# EAGLE design CDMU (EAGLE 6.4)

## Sheet 1 of 3
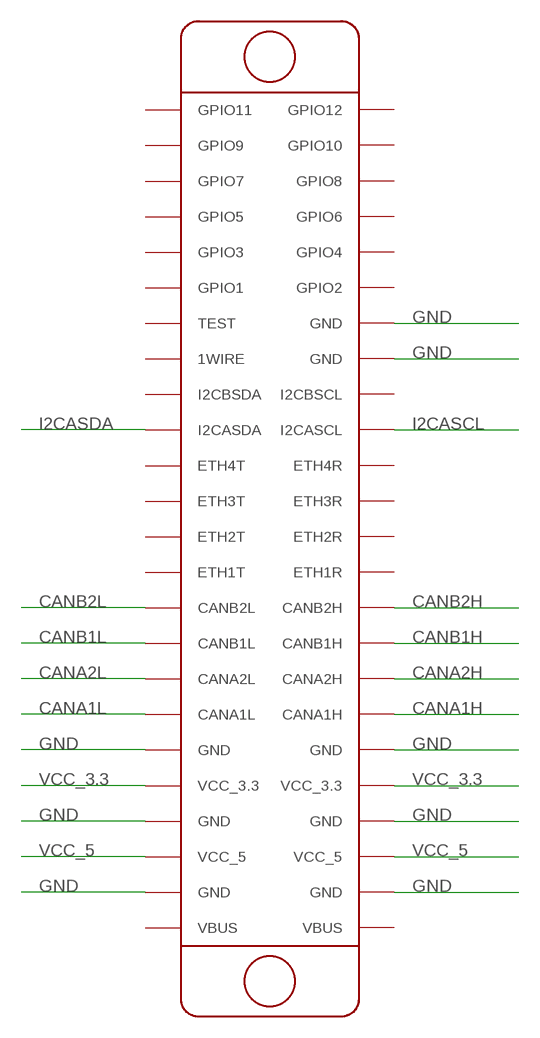
[diagram p0: schematic, sheet 1]

### Parts
U$1  CUBESAT_PCB  [CUBESAT_PCB]

### Nets
CANA1H: U$1.CANA1H ; also sheet 3
CANA1L: U$1.CANA1L ; also sheet 3
CANA2H: U$1.CANA2H ; also sheet 3
CANA2L: U$1.CANA2L ; also sheet 3
CANB1H: U$1.CANB1H ; also sheet 3
CANB1L: U$1.CANB1L ; also sheet 3
CANB2H: U$1.CANB2H ; also sheet 3
CANB2L: U$1.CANB2L ; also sheet 3
GND: U$1.GND@5(GND) U$1.GND@6(GND) U$1.GND@7(GND) U$1.GND@8(GND) U$1.GND@9(GND) U$1.GND@10(GND) U$1.GND@11(GND) U$1.GND@12(GND) ; also sheet 2,3
I2CASCL: U$1.I2CASCL ; also sheet 2
I2CASDA: U$1.I2CASDA ; also sheet 2
VCC_3.3: U$1.VCC_3.3@1(VCC_3.3) U$1.VCC_3.3@2(VCC_3.3) ; also sheet 2,3
VCC_5: U$1.VCC_5@1(VCC_5) U$1.VCC_5@2(VCC_5) ; also sheet 2
Unconnected: U$1.1WIRE U$1.ETH1R U$1.ETH1T U$1.ETH2R U$1.ETH2T U$1.ETH3R U$1.ETH3T U$1.ETH4R U$1.ETH4T U$1.GPIO1 U$1.GPIO2 U$1.GPIO3 U$1.GPIO4 U$1.GPIO5 U$1.GPIO6 U$1.GPIO7 U$1.GPIO8 U$1.GPIO9 U$1.GPIO10 U$1.GPIO11 U$1.GPIO12 U$1.I2CBSCL U$1.I2CBSDA U$1.TEST U$1.VBUS@1(VBUS) U$1.VBUS@2(VBUS)

## Sheet 2 of 3
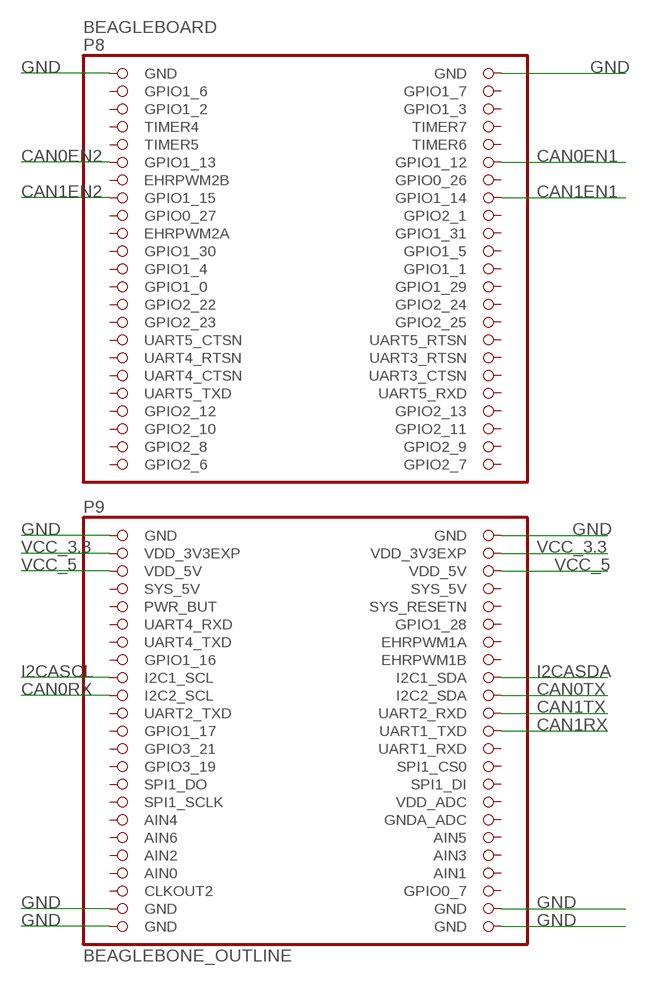
[diagram p1: schematic, sheet 2]

### Parts
BEAGLEBOARD  BEAGLEBONE_OUTLINE  [BEAGLEBONE_SHIELD]

### Nets
CAN0EN1: BEAGLEBOARD.12(GPIO1_12) ; also sheet 3
CAN0EN2: BEAGLEBOARD.11(GPIO1_13) ; also sheet 3
CAN0RX: BEAGLEBOARD.65(I2C2_SCL) ; also sheet 3
CAN0TX: BEAGLEBOARD.66(I2C2_SDA) ; also sheet 3
CAN1EN1: BEAGLEBOARD.16(GPIO1_14) ; also sheet 3
CAN1EN2: BEAGLEBOARD.15(GPIO1_15) ; also sheet 3
CAN1RX: BEAGLEBOARD.70(UART1_TXD) ; also sheet 3
CAN1TX: BEAGLEBOARD.68(UART2_RXD) ; also sheet 3
GND: BEAGLEBOARD.1(GND) BEAGLEBOARD.2(GND) BEAGLEBOARD.47(GND) BEAGLEBOARD.48(GND) BEAGLEBOARD.89(GND) BEAGLEBOARD.90(GND) BEAGLEBOARD.91(GND) BEAGLEBOARD.92(GND) ; also sheet 1,3
I2CASCL: BEAGLEBOARD.63(I2C1_SCL) ; also sheet 1
I2CASDA: BEAGLEBOARD.64(I2C1_SDA) ; also sheet 1
VCC_3.3: BEAGLEBOARD.49(VDD_3V3EXP) BEAGLEBOARD.50(VDD_3V3EXP) ; also sheet 1,3
VCC_5: BEAGLEBOARD.51(VDD_5V) BEAGLEBOARD.52(VDD_5V) ; also sheet 1
Unconnected: BEAGLEBOARD.3(GPIO1_6) BEAGLEBOARD.4(GPIO1_7) BEAGLEBOARD.5(GPIO1_2) BEAGLEBOARD.6(GPIO1_3) BEAGLEBOARD.7(TIMER4) BEAGLEBOARD.8(TIMER7) BEAGLEBOARD.9(TIMER5) BEAGLEBOARD.10(TIMER6) BEAGLEBOARD.13(EHRPWM2B) BEAGLEBOARD.14(GPIO0_26) BEAGLEBOARD.17(GPIO0_27) BEAGLEBOARD.18(GPIO2_1) BEAGLEBOARD.19(EHRPWM2A) BEAGLEBOARD.20(GPIO1_31) BEAGLEBOARD.21(GPIO1_30) BEAGLEBOARD.22(GPIO1_5) BEAGLEBOARD.23(GPIO1_4) BEAGLEBOARD.24(GPIO1_1) BEAGLEBOARD.25(GPIO1_0) BEAGLEBOARD.26(GPIO1_29) BEAGLEBOARD.27(GPIO2_22) BEAGLEBOARD.28(GPIO2_24) BEAGLEBOARD.29(GPIO2_23) BEAGLEBOARD.30(GPIO2_25) BEAGLEBOARD.31(UART5_CTSN) BEAGLEBOARD.32(UART5_RTSN) BEAGLEBOARD.33(UART4_RTSN) BEAGLEBOARD.34(UART3_RTSN) BEAGLEBOARD.35(UART4_CTSN) BEAGLEBOARD.36(UART3_CTSN) BEAGLEBOARD.37(UART5_TXD) BEAGLEBOARD.38(UART5_RXD) BEAGLEBOARD.39(GPIO2_12) BEAGLEBOARD.40(GPIO2_13) BEAGLEBOARD.41(GPIO2_10) BEAGLEBOARD.42(GPIO2_11) BEAGLEBOARD.43(GPIO2_8) BEAGLEBOARD.44(GPIO2_9) BEAGLEBOARD.45(GPIO2_6) BEAGLEBOARD.46(GPIO2_7) BEAGLEBOARD.54(SYS_5V) BEAGLEBOARD.55(PWR_BUT) BEAGLEBOARD.56(SYS_RESETN) BEAGLEBOARD.57(UART4_RXD) BEAGLEBOARD.58(GPIO1_28) BEAGLEBOARD.59(UART4_TXD) BEAGLEBOARD.60(EHRPWM1A) BEAGLEBOARD.61(GPIO1_16) BEAGLEBOARD.62(EHRPWM1B) BEAGLEBOARD.67(UART2_TXD) BEAGLEBOARD.69(GPIO1_17) BEAGLEBOARD.71(GPIO3_21) BEAGLEBOARD.72(UART1_RXD) BEAGLEBOARD.73(GPIO3_19) BEAGLEBOARD.74(SPI1_CS0) BEAGLEBOARD.75(SPI1_DO) BEAGLEBOARD.76(SPI1_DI) BEAGLEBOARD.77(SPI1_SCLK) BEAGLEBOARD.78(VDD_ADC) BEAGLEBOARD.79(AIN4) BEAGLEBOARD.80(GNDA_ADC) BEAGLEBOARD.81(AIN6) BEAGLEBOARD.82(AIN5) BEAGLEBOARD.83(AIN2) BEAGLEBOARD.84(AIN3) BEAGLEBOARD.86(AIN1) BEAGLEBOARD.87(CLKOUT2) BEAGLEBOARD.88(GPIO0_7)

## Sheet 3 of 3
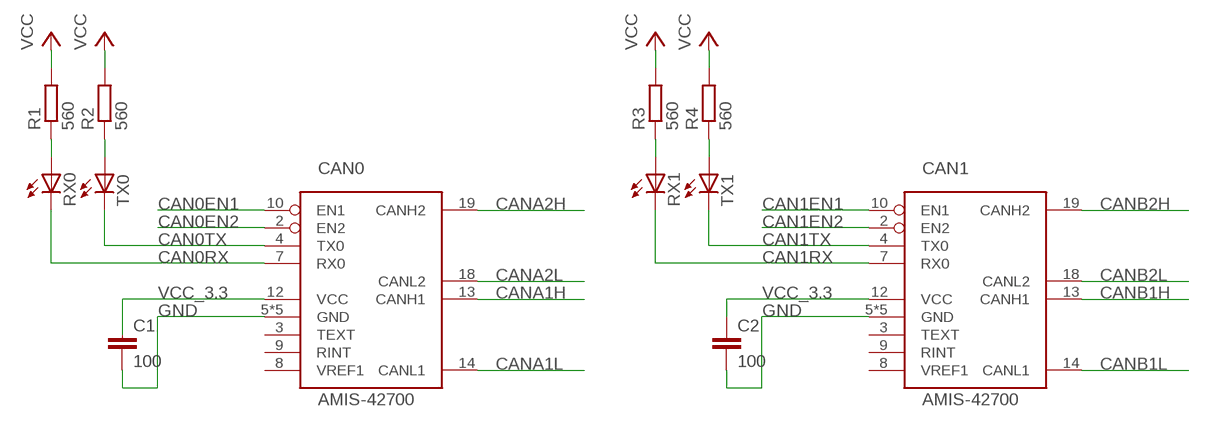
[diagram p2: schematic, sheet 3]

### Parts
C1  100  C-EUC0805  [C0805]
C2  100  C-EUC0805  [C0805]
CAN0  AMIS-42700  [SOIC20]
CAN1  AMIS-42700  [SOIC20]
R1  560  R-EU_R0805  [R0805]
R2  560  R-EU_R0805  [R0805]
R3  560  R-EU_R0805  [R0805]
R4  560  R-EU_R0805  [R0805]
RX0  LED3MM  [LED3MM]
RX1  LED3MM  [LED3MM]
TX0  LED3MM  [LED3MM]
TX1  LED3MM  [LED3MM]

### Nets
CAN0EN1: CAN0.10(EN1) ; also sheet 2
CAN0EN2: CAN0.2(EN2) ; also sheet 2
CAN0RX: CAN0.7(RX0) RX0.K(C) ; also sheet 2
CAN0TX: CAN0.4(TX0) TX0.K(C) ; also sheet 2
CAN1EN1: CAN1.10(EN1) ; also sheet 2
CAN1EN2: CAN1.2(EN2) ; also sheet 2
CAN1RX: CAN1.7(RX0) RX1.K(C) ; also sheet 2
CAN1TX: CAN1.4(TX0) TX1.K(C) ; also sheet 2
CANA1H: CAN0.13(CANH1) ; also sheet 1
CANA1L: CAN0.14(CANL1) ; also sheet 1
CANA2H: CAN0.19(CANH2) ; also sheet 1
CANA2L: CAN0.18(CANL2) ; also sheet 1
CANB1H: CAN1.13(CANH1) ; also sheet 1
CANB1L: CAN1.14(CANL1) ; also sheet 1
CANB2H: CAN1.19(CANH2) ; also sheet 1
CANB2L: CAN1.18(CANL2) ; also sheet 1
GND: C1.2 C2.2 CAN0.5(GND) CAN0.6(GND) CAN0.15(GND) CAN0.16(GND) CAN0.17(GND) CAN1.5(GND) CAN1.6(GND) CAN1.15(GND) CAN1.16(GND) CAN1.17(GND) ; also sheet 1,2
N$1: R1.1 RX0.A
N$2: R2.1 TX0.A
N$3: R3.1 RX1.A
N$4: R4.1 TX1.A
VCC_3.3: C1.1 C2.1 CAN0.12(VCC) CAN1.12(VCC) R1.2 R2.2 R3.2 R4.2 ; supply symbol labelled VCC ; also sheet 1,2
Unconnected: CAN0.3(TEXT) CAN0.8(VREF1) CAN0.9(RINT) CAN1.3(TEXT) CAN1.8(VREF1) CAN1.9(RINT)

## Power pins joined to a net without a drawn wire
AIN0: BEAGLEBOARD.85(AIN0)
SYS_5V: BEAGLEBOARD.53(SYS_5V)

## Library data of the parts
BEAGLEBOARD = beaglebone:BEAGLEBONE_OUTLINE: Should match A3 pinout - but not completely tested
C1 C2 = rcl:C-EU: CAPACITOR, European symbol
CAN0 CAN1 = amis(1):AMIS-42700
R1-R4 = rcl:R-EU_: RESISTOR, European symbol
RX0 RX1 TX0 TX1 = adafruit:LED: LED OSRAM: - CHIPLED LG R971, LG N971, LY N971, LG Q971, LY Q971, LO R971, LY R971 LH N974, LH R974 LS Q976, LO Q976, LY Q976 LO Q996 - Hyper CHIPLED LW Q18S LB Q993, LB Q99A, LB R99A - SideLED LS A670, LO A670, LY A670, LG A670, LP A670 LB A673, LV A673, LT A673, LW A673 LH A674 LY A675 LS A676, LA A676, LO A676, LY A676, LW A676 LS A679, LY A679, LG A679 - Hyper Micro SIDELED® LS Y876, LA Y876, LO Y876, LY Y876 LT Y87S - SmartLED LW L88C, LW L88S LB L89C, LB L89S, LG L890 LS L89K, LO L89K, LY L89K LS L896, LA L896, LO L896, LY L896 - TOPLED LS T670, LO T670, LY T670, LG T670, LP T670 LSG T670, LSP T670, LSY T670, LOP T670, LYG T670 LG T671, LOG T671, LSG T671 LB T673, LV T673, LT T673, LW T673 LH T674 LS T676, LA T676, LO T676, LY T676, LB T676, LH T676, LSB T676, LW T676 LB T67C, LV T67C, LT T67C, LS T67K, LO T67K, LY T67K, LW E67C LS E67B, LA E67B, LO E67B, LY E67B, LB E67C, LV E67C, LT E67C LW T67C LS T679, LY T679, LG T679 LS T770, LO T770, LY T770, LG T770, LP T770 LB T773, LV T773, LT T773, LW T773 LH T774 LS E675, LA E675, LY E675, LS T675 LS T776, LA T776, LO T776, LY T776, LB T776 LHGB T686 LT T68C, LB T68C - Hyper Mini TOPLED® LB M676 - Mini TOPLED Santana® LG M470 LS M47K, LO M47K, LY M47K Source: http://www.osram.convergy.de/
U$1 = CubeSat_PCB_bis:CUBESAT_PCB: OpenCube PCB

## Board
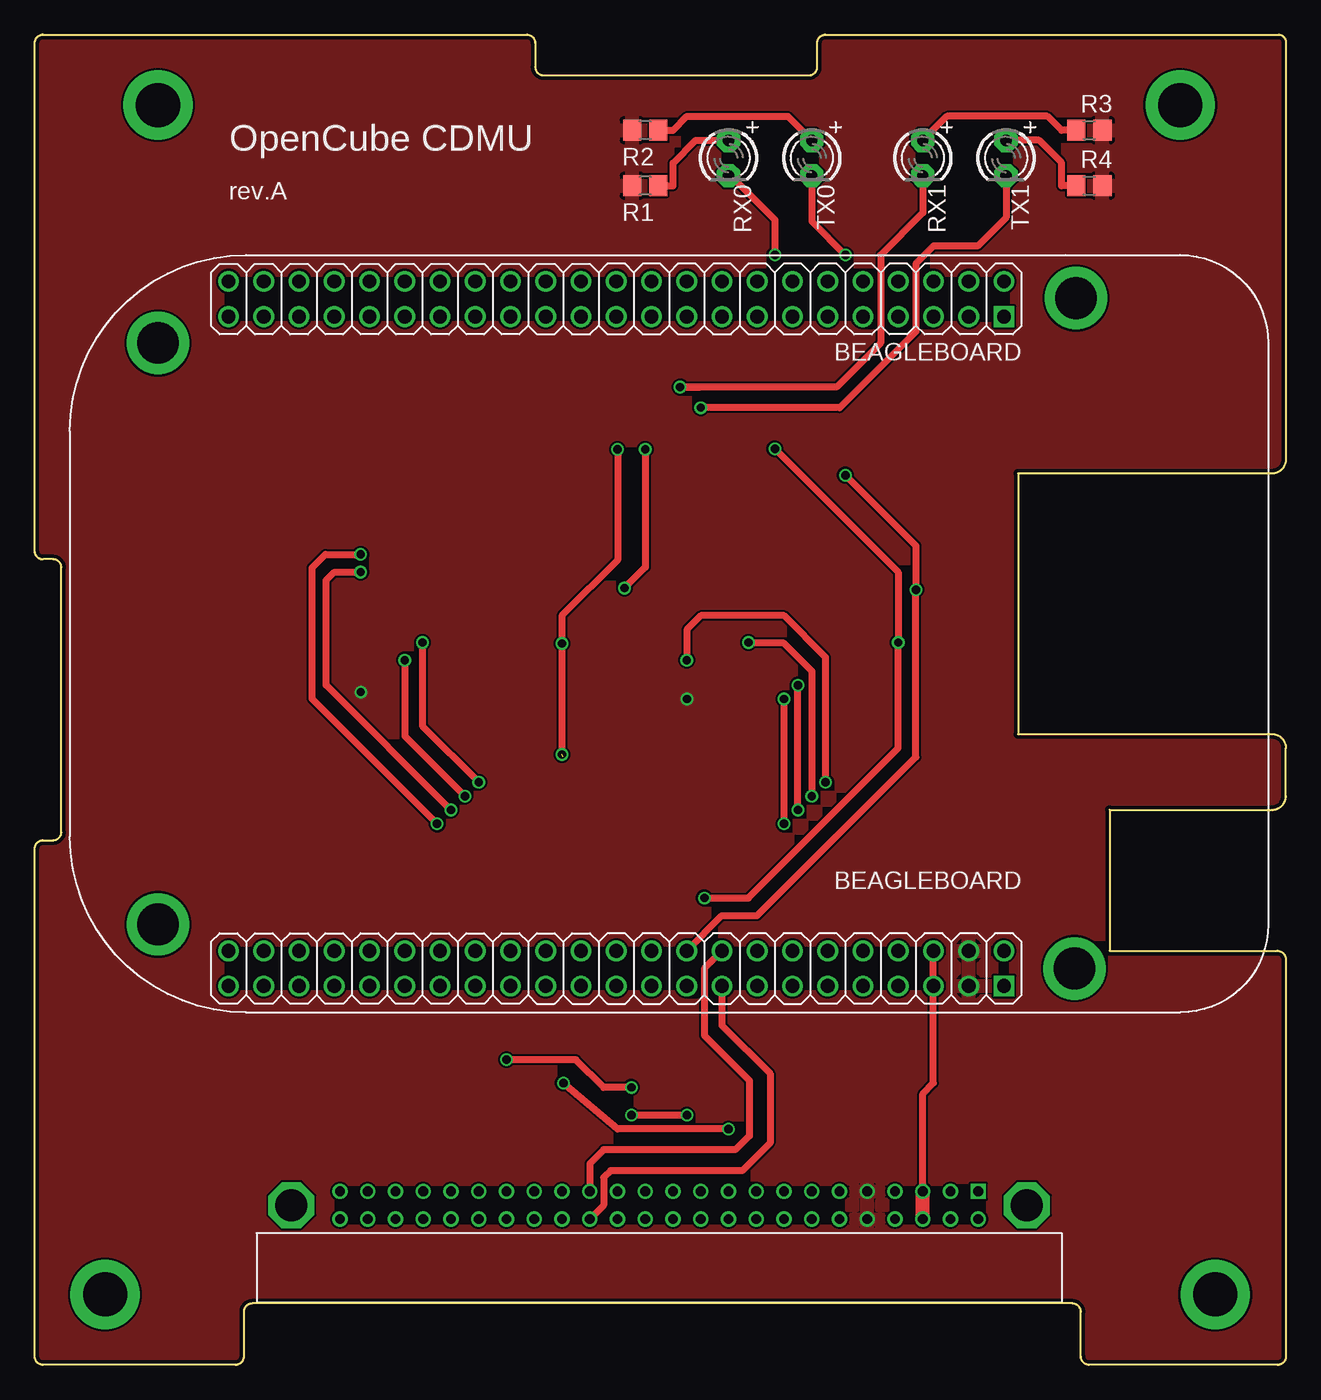
[diagram p3: board, top side]
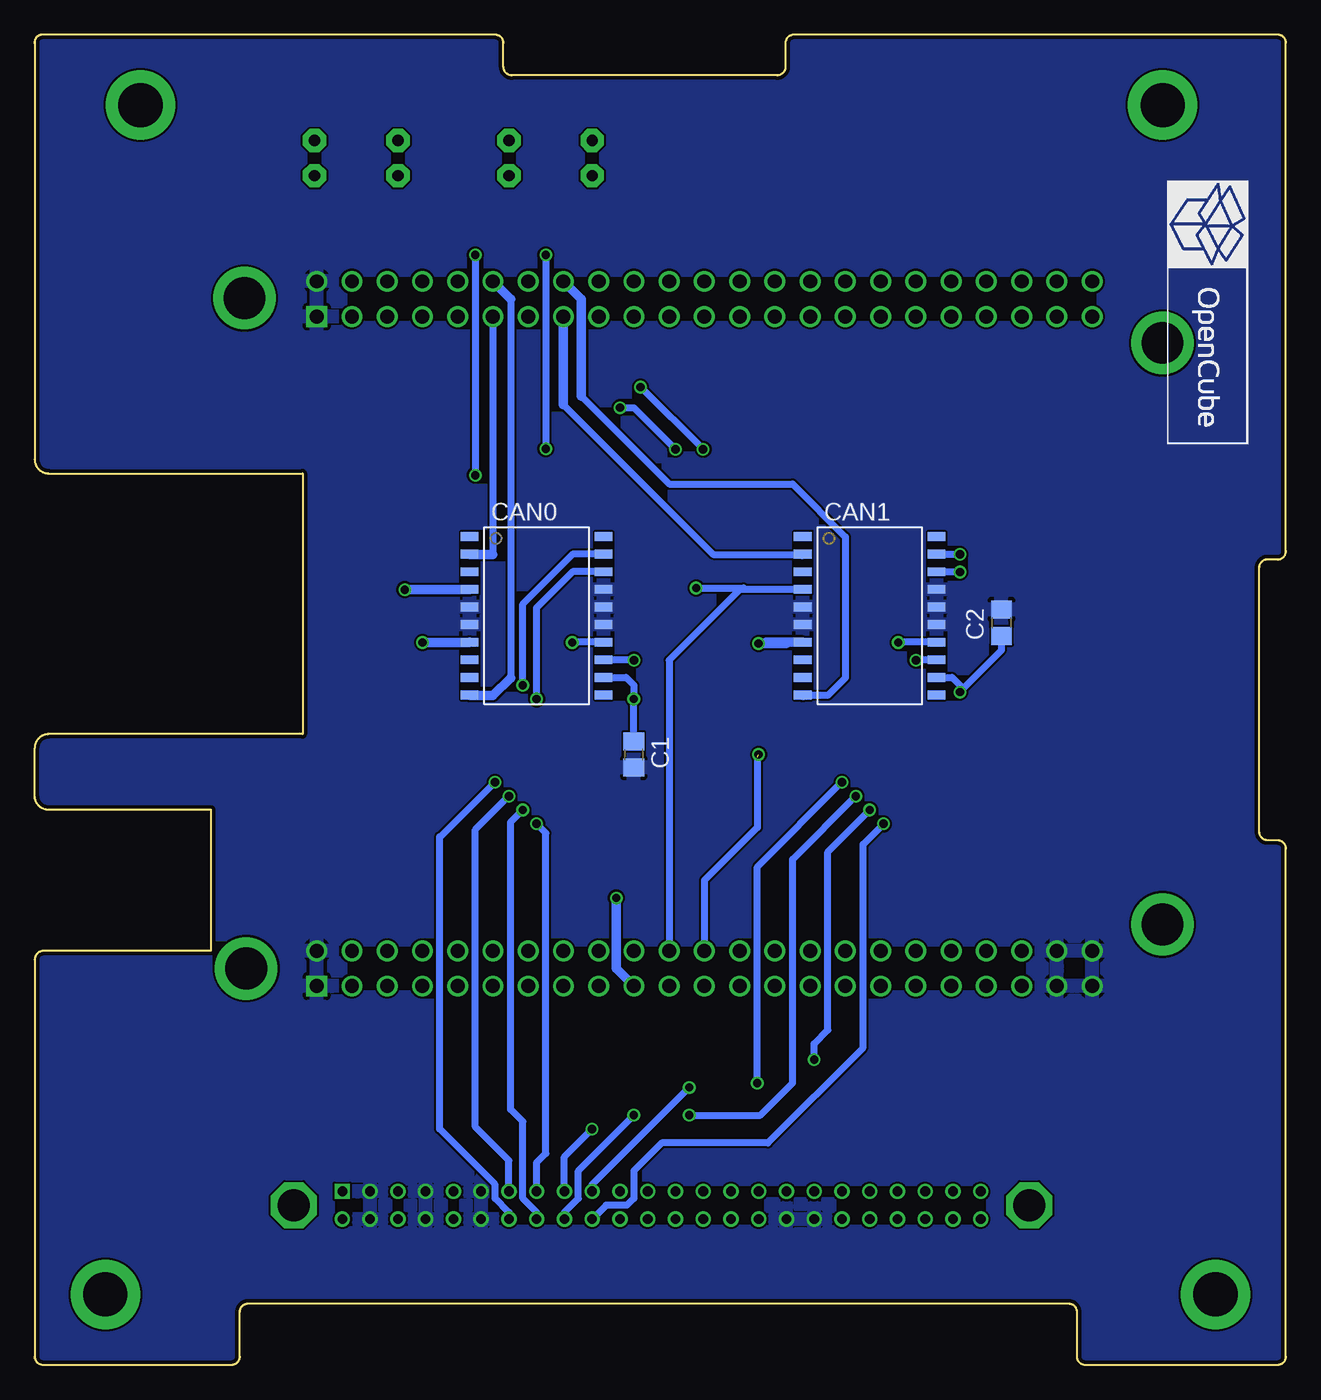
[diagram p4: board, bottom side, seen from below]

Size 90.17 x 95.89 mm. Coordinates in mm from the lower left corner, seen from the top.
Outline: 90.17,95.25 90.17,65.26 arc-90 89.17,64.26 70.87,64.26 70.87,45.47 89.17,45.47 arc-90 90.17,44.47 90.17,41.01 arc-90 89.17,40.01 77.47,40.01 77.47,29.84 89.53,29.84 arc-90 90.17,29.21 90.17,0.51
Copper layers (1*2*15*16): Top 0.035mm / dielectric 0.2mm / Route2 0.0175mm / dielectric 1.1mm / Route15 0.0175mm / dielectric 0.2mm / Bottom 0.035mm
Design rules "SeeedStudio_DRU_no_angle_20130527 *": minimum track width 6mil, minimum drill 12mil, track to track 6mil, track to pad 6mil, pad to pad 6mil, via to via 6mil, smd to smd 0mil, copper to edge 10mil, drill to drill 10mil, minimum pad ring 6mil, minimum via ring 6mil, stop-mask expansion 2mil, vias tented up to drill 25mil, thermal gap 10mil

### Footprints (pad centres in the part's own frame; a part is rotated, then mirrored left to right if it is on the bottom)
BEAGLEBONE_SHIELD = drill 1 square: 1 50.165,19.05; 47 1.905,19.05 | drill 1: 2 52.705,19.05; 3 50.165,21.59; 4 52.705,21.59; 5 50.165,24.13; 6 52.705,24.13; 7 50.165,26.67; 8 52.705,26.67; 9 50.165,29.21; 10 52.705,29.21; 11 50.165,31.75; 12 52.705,31.75; 13 50.165,34.29; 14 52.705,34.29; 15 50.165,36.83; 16 52.705,36.83; 17 50.165,39.37; 18 52.705,39.37; 19 50.165,41.91; 20 52.705,41.91; 21 50.165,44.45; 22 52.705,44.45; 23 50.165,46.99; 24 52.705,46.99; 25 50.165,49.53; 26 52.705,49.53; 27 50.165,52.07; 28 52.705,52.07; 29 50.165,54.61; 30 52.705,54.61; 31 50.165,57.15; 32 52.705,57.15; 33 50.165,59.69; 34 52.705,59.69; 35 50.165,62.23; 36 52.705,62.23; 37 50.165,64.77; 38 52.705,64.77; 39 50.165,67.31; 40 52.705,67.31; 41 50.165,69.85; 42 52.705,69.85; 43 50.165,72.39; 44 52.705,72.39; 45 50.165,74.93; 46 52.705,74.93; 48 4.445,19.05; 49 1.905,21.59; 50 4.445,21.59; 51 1.905,24.13; 52 4.445,24.13; 53 1.905,26.67; 54 4.445,26.67; 55 1.905,29.21; 56 4.445,29.21; 57 1.905,31.75; 58 4.445,31.75; 59 1.905,34.29; 60 4.445,34.29; 61 1.905,36.83; 62 4.445,36.83; 63 1.905,39.37; 64 4.445,39.37; 65 1.905,41.91; 66 4.445,41.91; 67 1.905,44.45; 68 4.445,44.45; 69 1.905,46.99; 70 4.445,46.99; 71 1.905,49.53; 72 4.445,49.53; 73 1.905,52.07; 74 4.445,52.07; 75 1.905,54.61; 76 4.445,54.61; 77 1.905,57.15; 78 4.445,57.15; 79 1.905,59.69; 80 4.445,59.69; 81 1.905,62.23; 82 4.445,62.23; 83 1.905,64.77; 84 4.445,64.77; 85 1.905,67.31; 86 4.445,67.31; 87 1.905,69.85; 88 4.445,69.85; 89 1.905,72.39; 90 4.445,72.39; 91 1.905,74.93; 92 4.445,74.93 | drill 3 pad 4.5: P$1 51.5,13.85; P$2 3.175,13.97; P$3 48.26,80.01; P$4 6.35,80.01
C0805 = smd 1.3 x 1.5: 1 -0.95,0; 2 0.95,0
SOIC20 = smd 1.27 x 0.635: 1 -4.826,5.715; 2 -4.826,4.445; 3 -4.826,3.175; 4 -4.826,1.905; 5 -4.826,0.635; 6 -4.826,-0.635; 7 -4.826,-1.905; 8 -4.826,-3.175; 9 -4.826,-4.445; 10 -4.826,-5.715; 11 4.826,-5.715; 12 4.826,-4.445; 13 4.826,-3.175; 14 4.826,-1.905; 15 4.826,-0.635; 16 4.826,0.635; 17 4.826,1.905; 18 4.826,3.175; 19 4.826,4.445; 20 4.826,5.715
R0805 = smd 1.3 x 1.5: 1 -0.95,0; 2 0.95,0
LED3MM = drill 0.813 pad 1.676 octagon: A -1.27,0; K 1.27,0
CUBESAT_PCB = drill 0.7 pad 1.1: 1WIRE 36,12.5; CANA1H 56,10.5; CANA1L 56,12.5; CANA2H 54,10.5; CANA2L 54,12.5; CANB1H 52,10.5; CANB1L 52,12.5; CANB2H 50,10.5; CANB2L 50,12.5; ETH1R 48,10.5; ETH1T 48,12.5; ETH2R 46,10.5; ETH2T 46,12.5; ETH3R 44,10.5; ETH3T 44,12.5; ETH4R 42,10.5; ETH4T 42,12.5; GND@5 66,12.5; GND@6 66,10.5; GND@7 62,12.5; GND@8 62,10.5; GND@9 58,12.5; GND@10 58,10.5; GND@11 36,10.5; GND@12 34,10.5; GPIO1 32,12.5; GPIO2 32,10.5; GPIO3 30,12.5; GPIO4 30,10.5; GPIO5 28,12.5; GPIO6 28,10.5; GPIO7 26,12.5; GPIO8 26,10.5; GPIO9 24,12.5; GPIO10 24,10.5; GPIO11 22,12.5; GPIO12 22,10.5; I2CASCL 40,10.5; I2CASDA 40,12.5; I2CBSCL 38,10.5; I2CBSDA 38,12.5; TEST 34,12.5; VBUS@2 68,10.5; VCC_3.3@1 60,12.5; VCC_3.3@2 60,10.5; VCC_5@1 64,12.5; VCC_5@2 64,10.5 | drill 3.18 pad 5: GND@1 5.08,5.08; GND@2 8.89,90.81; GND@3 82.55,90.81; GND@4 85.08,5.08 | drill 2.3 pad 3.2 octagon: GND@13 18.5,11.5; GND@14 71.5,11.5 | drill 0.7 pad 1.1 square: VBUS@1 68,12.5

### Placement (x,y rotation side)
BEAGLEBOARD  88.9,25.4 90 top
C1  47,44 270 bottom
C2  20.5,53.5 90 bottom
CAN0  54,54 0 bottom
CAN1  30,54 0 bottom
R1  44,85 180 top
R2  44,89 180 top
R3  76,89 0 top
R4  76,85 0 top
RX0  50,87 270 top
RX1  64,87 270 top
TX0  56,87 270 top
TX1  70,87 270 top
U$1  0,0 0 top

### Tracks (layer width: path | path; a pad name or v marks a point on that pad's centre or on a via)
CAN0EN1
  Bottom 0.5: 55.88,76.83 55.88,49.53
  Bottom 0.7: BEAGLEBOARD.12 55.88,76.83 | 55.88,49.53 57.15,48.26 58.8,48.26 CAN0.10
CAN0EN2
  Bottom 0.5: BEAGLEBOARD.11 57.15,58.42
  Bottom 0.7: 57.15,58.42 58.83,58.42 CAN0.2
CAN0RX  (via drill 0.6)
  Top 0.5: v48.26,33.66 51.44,33.66 62.23,44.45 v62.23,52.07 62.23,57.15 v53.34,66.04 | RX0.K 50.16,85.73 53.34,82.55 v53.34,80.01
  Bottom 0.5: v53.34,80.01 v53.34,66.04
  Bottom 0.7: BEAGLEBOARD.65 48.26,28.57 v48.26,33.66 | v62.23,52.07 58.85,52.07 CAN0.7
CAN0TX  (via drill 0.6)
  Top 0.5: BEAGLEBOARD.66 49.53,32.38 52.07,32.38 63.5,43.81 v63.5,55.88 63.5,59.05 v58.42,64.14 | TX0.K 56,82.43 v58.42,80.01
  Bottom 0.5: v58.42,80.01 v58.42,64.14
  Bottom 0.7: v63.5,55.88 58.85,55.88 CAN0.4
CAN1EN1
  Bottom 0.5: 50.8,69.85 44.45,63.5 35.56,63.5 31.75,59.69 31.75,49.53 33.02,48.26 34.8,48.26
  Bottom 0.7: BEAGLEBOARD.16 50.8,76.83 50.8,69.85 | 34.8,48.26 CAN1.10
CAN1EN2
  Bottom 0.5: 52.07,69.22 41.27,58.42 34.85,58.42
  Bottom 0.7: BEAGLEBOARD.15 52.07,69.22 | 34.85,58.42 CAN1.2
CAN1RX  (via drill 0.6)  (1 unrouted)
  Top 0.5: v38,44 v38,52 38,54 42,58 v42,66 | RX1.K 64,83.05 60.96,80.01 60.96,73.66 57.78,70.48 v46.52,70.48 48,70.5
  Bottom 0.5: 38.1,43.81 38.1,38.73 41.91,34.92 BEAGLEBOARD.70 | v46.52,70.48 46.48,70.48 v42,66
  Bottom 0.7: CAN1.7 36,52.09 | 36,52.09 37.44,52.09 37.47,52.07 | v38,52 36,52 36,52.09
CAN1TX  (via drill 0.6)
  Top 0.5: TX1.K 70,82.7 67.94,80.64 64.77,80.64 63.5,79.38 63.5,74.5 58,69 v48,69 | v44,66 44,57.5 v42.5,56
  Bottom 0.5: CAN1.4 39,55.91 | 39,55.91 39.34,55.91 44.45,50.8 BEAGLEBOARD.68 | v48,69 47,69 v44,66 | v42.5,56 39.09,56 39,55.91
CANA1H  (via drill 0.6)
  Top 0.5: v57,42 57,51 54,54 48,54 47,53 v47,50.81 v46.99,50.8
  Bottom 0.5: U$1.CANA1H 56,11 57,12 57,13 61,17 61,38.06 60.94,38.06 v57,42 | v46.99,50.8 49.15,50.8 CAN0.13
CANA1L  (via drill 0.6)
  Top 0.5: v51.44,52.07 53.93,52.07 56,50 v56,41
  Bottom 0.5: U$1.CANA1L 56,14.72 58.42,17.14 58.42,38.58 v56,41 | CAN0.14 51.41,52.09 v51.44,52.07
CANA2H  (via drill 0.6)
  Top 0.5: v55,40 v55,49
  Bottom 0.5: U$1.CANA2H 54,11 55,12 55,17.54 55.88,18.41 55.88,39.12 v55,40 | CAN0.19 51.41,58.45 55,54.85 v55,49
CANA2L  (via drill 0.6)
  Top 0.5: v54,39 v54,48
  Bottom 0.5: U$1.CANA2L 54,14.58 53.34,15.24 53.34,38.34 v54,39 | CAN0.18 51.41,57.17 54,54.59 v54,48
CANB1H  (via drill 0.6)
  Top 0.5: v47,18 v43,18 | v26.67,50.8 26.67,45.33 v31,41
  Bottom 0.5: U$1.CANB1H 52,11 51,12 51,14 v47,18 | v43,18 37.88,18 35.56,20.32 35.56,36.44 v31,41 | CAN1.13 26.64,50.83 v26.67,50.8
CANB1L  (via drill 0.6)
  Top 0.5: v50,17 42,17 v38.1,20.32 | v27.94,52.07 27.94,46.06 v32,42
  Bottom 0.5: U$1.CANB1L 52,15 v50,17 | v38.1,20.32 38.1,35.9 v32,42 | CAN1.14 27.91,52.09 v27.94,52.07
CANB2H  (via drill 0.6)
  Top 0.5: v29,39 20,48 20,57.47 20.95,58.42 v23.5,58.42
  Bottom 0.5: v29,39 30.48,37.52 30.48,22.86 37.34,16 45,16 47,14 47,12 47.5,11.5 49,11.5 U$1.CANB2H | CAN1.19 23.52,58.45 v23.5,58.42
CANB2L  (via drill 0.6)
  Top 0.5: v43,20 41,20 39,22 v34,22 | v30,40 21,49 21,56.56 21.59,57.15 v23.5,57.15
  Bottom 0.5: U$1.CANB2L 50,13 v43,20 | v34,22 34,23.15 33.02,24.13 33.02,36.98 v30,40 | CAN1.18 23.52,57.17 v23.5,57.15
GND
  pour Bottom: -2,98 -2,-2 92,-2 92,98
I2CASCL
  Top 0.5: BEAGLEBOARD.63 49.53,24.47 53,21 53,16 51,14 41.5,14 41,13.5 41,11.5 U$1.I2CASCL
I2CASDA
  Top 0.5: BEAGLEBOARD.64 48.26,28.57 48.26,23.74 51.5,20.5 51.5,16.5 50.5,15.5 41,15.5 40,14.5 U$1.I2CASDA
N$1
  Top 0.5: R1.1 46,85 46,86.64 47.62,88.27 RX0.A
N$2
  Top 0.5: R2.1 46,89 47,90 54.27,90 TX0.A
N$3
  Top 0.5: R3.1 74,89 73,90 65.73,90 RX1.A
N$4
  Top 0.5: R4.1 74,85 74,86.66 72.39,88.27 TX1.A
VCC_3.3  (via drill 0.6)
  Bottom 0.5: CAN0.12 47.55,49.55 47,49 v47,48 C1.1 | CAN1.12 24.05,49.55 23.5,49 v23.5,48.5 20.5,51.5 C2.1
  pour Top: -5,100 -5,-5 95,-5 95,100
VCC_5
  Top 0.5: BEAGLEBOARD.51 BEAGLEBOARD.52 64.77,20.32 64,19.55 U$1.VCC_5@1
  Top 1: U$1.VCC_5@2 U$1.VCC_5@1

### Text on the board
tPlace: OpenCube CDMU | rev.A